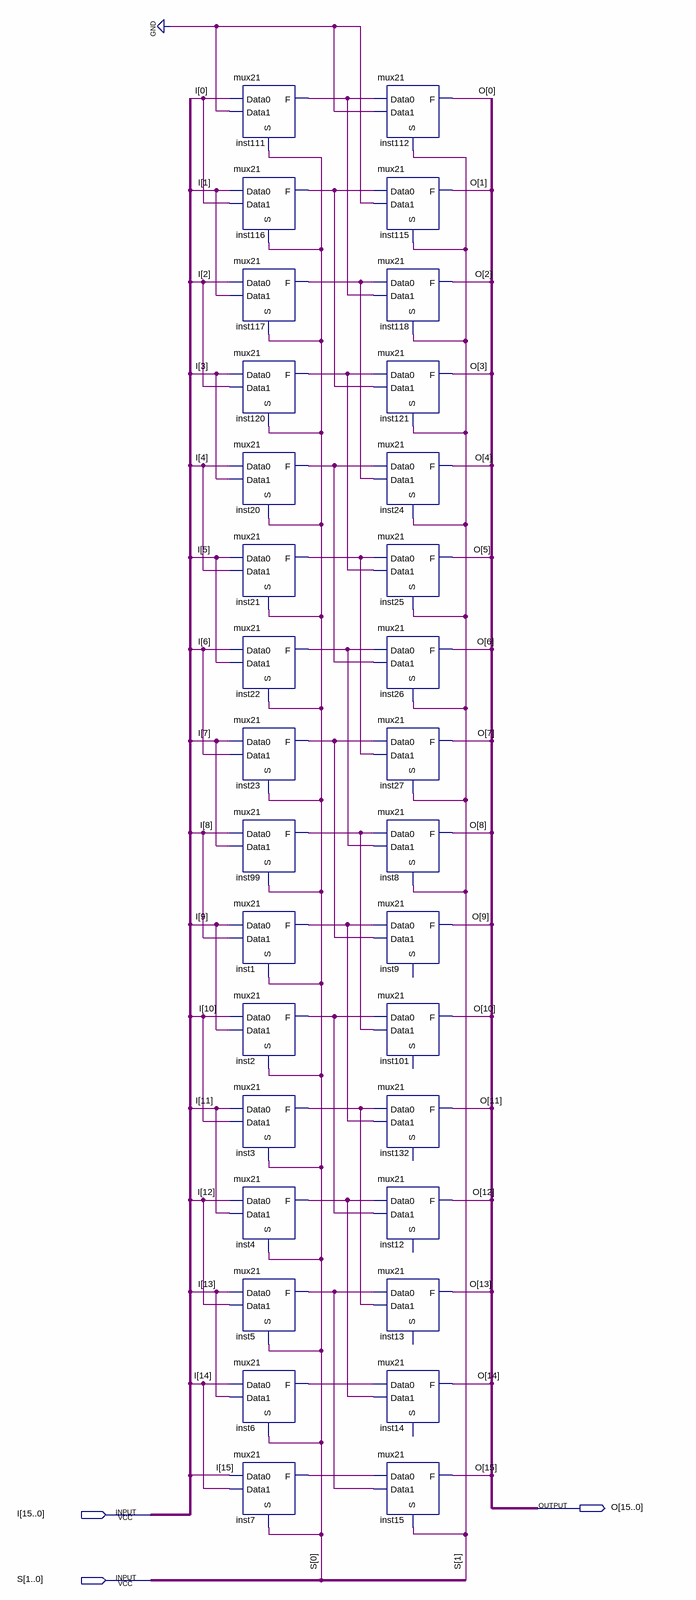
[diagram p0: schematic sheet]
// Quartus schematic ShiftLeft16.bdf as structural Verilog: 32 symbols, 3 pins
module ShiftLeft16 (
  input  [15:0] I,
  input  [1:0] S,
  output [15:0] O
);

  wire inst1_f, inst2_f, inst3_f, inst4_f, inst5_f, inst6_f, inst7_f, inst20_f, inst21_f, inst22_f, inst23_f,
       inst99_f, inst111_f, inst116_f, inst117_f, inst120_f;

  mux21 inst111 (.Data0(I[0]), .Data1(1'b0), .S(S[0]), .F(inst111_f));
  mux21 inst116 (.Data0(I[1]), .Data1(I[0]), .S(S[0]), .F(inst116_f));
  mux21 inst117 (.Data0(I[2]), .Data1(I[1]), .S(S[0]), .F(inst117_f));
  mux21 inst120 (.Data0(I[3]), .Data1(I[2]), .S(S[0]), .F(inst120_f));
  mux21 inst20 (.Data0(I[4]), .Data1(I[3]), .S(S[0]), .F(inst20_f));
  mux21 inst21 (.Data0(I[5]), .Data1(I[4]), .S(S[0]), .F(inst21_f));
  mux21 inst22 (.Data0(I[6]), .Data1(I[5]), .S(S[0]), .F(inst22_f));
  mux21 inst23 (.Data0(I[7]), .Data1(I[6]), .S(S[0]), .F(inst23_f));
  mux21 inst99 (.Data0(I[8]), .Data1(I[7]), .S(S[0]), .F(inst99_f));
  mux21 inst1 (.Data0(I[9]), .Data1(I[8]), .S(S[0]), .F(inst1_f));
  mux21 inst2 (.Data0(I[10]), .Data1(I[9]), .S(S[0]), .F(inst2_f));
  mux21 inst3 (.Data0(I[11]), .Data1(I[10]), .S(S[0]), .F(inst3_f));
  mux21 inst4 (.Data0(I[12]), .Data1(I[11]), .S(S[0]), .F(inst4_f));
  mux21 inst5 (.Data0(I[13]), .Data1(I[12]), .S(S[0]), .F(inst5_f));
  mux21 inst6 (.Data0(I[14]), .Data1(I[13]), .S(S[0]), .F(inst6_f));
  mux21 inst7 (.Data0(I[15]), .Data1(I[14]), .S(S[0]), .F(inst7_f));
  mux21 inst112 (.Data0(inst111_f), .Data1(1'b0), .S(S[1]), .F(O[0]));
  mux21 inst115 (.Data0(inst116_f), .Data1(1'b0), .S(S[1]), .F(O[1]));
  mux21 inst118 (.Data0(inst117_f), .Data1(inst111_f), .S(S[1]), .F(O[2]));
  mux21 inst121 (.Data0(inst120_f), .Data1(inst116_f), .S(S[1]), .F(O[3]));
  mux21 inst24 (.Data0(inst20_f), .Data1(inst117_f), .S(S[1]), .F(O[4]));
  mux21 inst25 (.Data0(inst21_f), .Data1(inst120_f), .S(S[1]), .F(O[5]));
  mux21 inst26 (.Data0(inst22_f), .Data1(inst20_f), .S(S[1]), .F(O[6]));
  mux21 inst27 (.Data0(inst23_f), .Data1(inst21_f), .S(S[1]), .F(O[7]));
  mux21 inst8 (.Data0(inst99_f), .Data1(inst22_f), .S(S[1]), .F(O[8]));
  mux21 inst9 (.Data0(inst1_f), .Data1(inst23_f), .F(O[9]));  // open: S
  mux21 inst101 (.Data0(inst2_f), .Data1(inst99_f), .F(O[10]));  // open: S
  mux21 inst132 (.Data0(inst3_f), .Data1(inst1_f), .F(O[11]));  // open: S
  mux21 inst12 (.Data0(inst4_f), .Data1(inst2_f), .F(O[12]));  // open: S
  mux21 inst13 (.Data0(inst5_f), .Data1(inst3_f), .F(O[13]));  // open: S
  mux21 inst14 (.Data0(inst6_f), .Data1(inst4_f), .F(O[14]));  // open: S
  mux21 inst15 (.Data0(inst7_f), .Data1(inst5_f), .S(S[1]), .F(O[15]));
endmodule
